# Altium schematic sheet 主控原理图(AD档).SchDoc
size A3
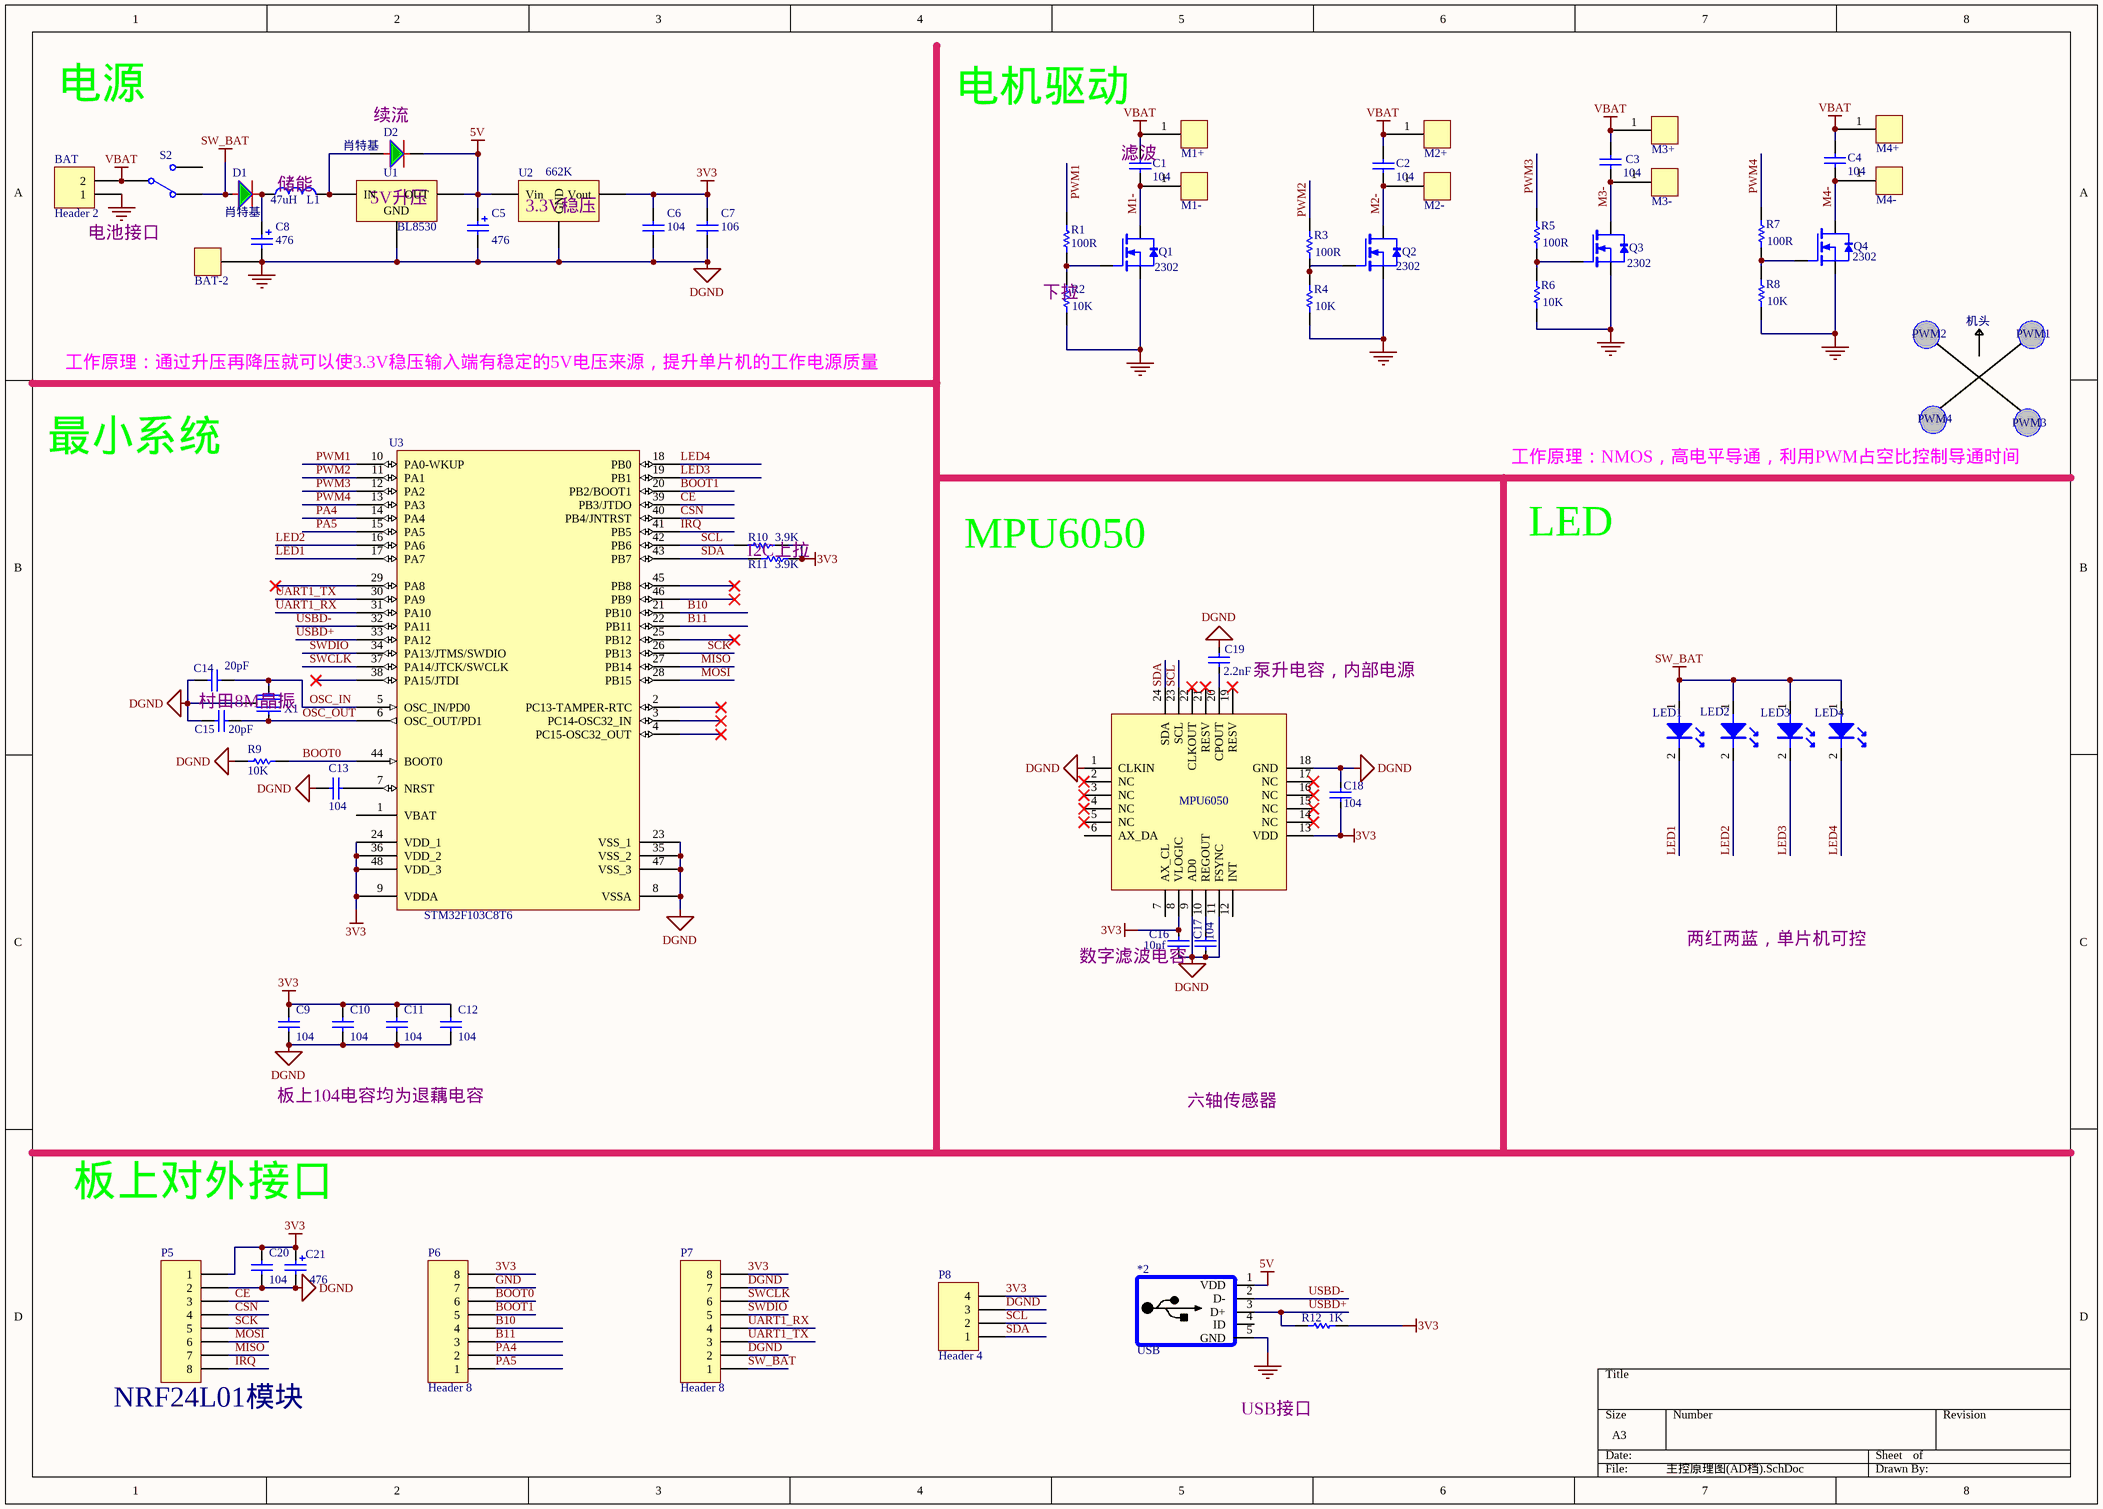
[diagram p0: 主控原理图(AD档).SchDoc]

## Parts
*2  USB  [USB]
BAT  Header 2  [HDR2]
BAT-2  Header 1  [电池接口]  (value not drawn)
C1  value 104  [0603C]  (hidden comment: Cap Chip 1206)
C2  104  [0603C]
C3  value 104  [0603C]  (hidden comment: Cap Chip 1206)
C4  value 104  [0603C]  (hidden comment: Cap Chip 1206)
C5  value 476  [1206c]  (hidden comment: Cap Tan A)
C6  value 104  [0603C]  (hidden comment: Cap Chip 1206)
C7  value 106  [0603c]  (hidden comment: Cap Chip 1206)
C8  value 476  [1206c]  (hidden comment: Cap Tan A)
C9  104  [0603C]
C10  104  [0603C]
C11  104  [0603C]
C12  104  [0603C]
C13  104  [0603C]
C14  20pF  [0603C]
C15  20pF  [0603C]
C16  value 10nf  [0603C]  (hidden comment: Cap_0603)
C17  value 104  [0603C]  (hidden comment: Cap_0603)
C18  value 104  [0603C]  (hidden comment: Cap_0603)
C19  value 2.2nF  [0603C]  (hidden comment: Cap_0603)
C20  104  [0603C]
C21  value 476  [1206c]  (hidden comment: Cap Tan A)
D1  肖特基  [0805d]
D2  肖特基  [0805d]
L1  value 47uH  [电感]  (hidden comment: Inductor Chip)
LED1  LED  [0603D]  (value not drawn)
LED2  LED  [0603D]  (value not drawn)
LED3  LED  [0603D]  (value not drawn)
LED4  LED  [0603D]  (value not drawn)
M1+  Header 1  [电池接口]  (value not drawn)
M1-  Header 1  [电池接口]  (value not drawn)
M2+  Header 1  [电池接口]  (value not drawn)
M2-  Header 1  [电池接口]  (value not drawn)
M3+  Header 1  [电池接口]  (value not drawn)
M3-  Header 1  [电池接口]  (value not drawn)
M4+  Header 1  [电池接口]  (value not drawn)
M4-  Header 1  [电池接口]  (value not drawn)
P5  NRF24L01模块  [2.4G]
P6  Header 8  [HDR8]
P7  Header 8  [HDR8]
P8  Header 4  [HDR4]
Q1  2302  [NMOS]
Q2  2302  [NMOS]
Q3  2302  [NMOS]
Q4  2302  [NMOS]
R1  value 100R  [0603R]  (hidden comment: Res1)
R2  value 10K  [0603R]  (hidden comment: Res1)
R3  value 100R  [0603R]  (hidden comment: Res1)
R4  value 10K  [0603R]  (hidden comment: Res1)
R5  value 100R  [0603R]  (hidden comment: Res1)
R6  value 10K  [0603R]  (hidden comment: Res1)
R7  value 100R  [0603R]  (hidden comment: Res1)
R8  value 10K  [0603R]  (hidden comment: Res1)
R9  value 10K  [0603R]  (hidden comment: Res1)
R10  value 3.9K  [0603R]  (hidden comment: Res1)
R11  value 3.9K  [0603R]  (hidden comment: Res1)
R12  value 1K  [0603R]  (hidden comment: Res1)
S2  SW-SPDT  [SWITCH]  (value not drawn)
U1  BL8530  [SOT-89]
U2  662K  [LDO]
U3  STM32F103C8T6  [LQFP48]
U8  MPU6050  [QFN24]
X1  XTAL_SMT  [OSC]  (value not drawn)

## Nets
3V3: C6.1 C7.1 C9.1 C10.1 C11.1 C12.1 C16.2 C18.1 C20.1 C21.2 P5.1 P6.8 P7.8 P8.4 R10.1 R11.1 R12.1 U2.2(Vout) U3.9(VDDA) U3.24(VDD_1) U3.36(VDD_2) U3.48(VDD_3) U8.8(VLOGIC) U8.13(VDD)
5V: *2.1(VDD) C5.2 D2.2 U1.2(OUT) U2.3(Vin)
DGND: *2.5(GND) BAT.1 BAT-2.1 C5.1 C6.2 C7.2 C8.1 C9.2 C10.2 C11.2 C12.2 C13.1 C14.2 C15.2 C16.1 C17.1 C18.2 C19.2 C20.2 C21.1 P5.2 P6.7 P7.2 P7.7 P8.3 Q1.3(S) Q2.3(S) Q3.3(S) Q4.3(S) R2.1 R4.1 R6.1 R8.1 R9.2 U1.1(GND) U2.1(GND) U3.8(VSSA) U3.23(VSS_1) U3.35(VSS_2) U3.47(VSS_3) U8.1(CLKIN) U8.9(AD0) U8.11(FSYNC) U8.18(GND) X1.0  [also labelled GND]
SW_BAT: D1.1 LED1.1 LED2.1 LED3.1 LED4.1 P7.1 S2.3
VBAT: BAT.2 C1.2 C2.2 C3.2 C4.2 M1+.1 M2+.1 M3+.1 M4+.1 S2.2
B10: P6.4 U3.21(PB10)
B11: P6.3 U3.22(PB11)
BOOT0: P6.6 R9.1 U3.44(BOOT0)
BOOT1: P6.5 U3.20(PB2/BOOT1)
CE: P5.3 U3.39(PB3/JTDO)
CSN: P5.4 U3.40(PB4/JNTRST)
IRQ: P5.8 U3.41(PB5)
LED1: LED1.2 U3.17(PA7)
LED2: LED2.2 U3.16(PA6)
LED3: LED3.2 U3.19(PB1)
LED4: LED4.2 U3.18(PB0)
M1-: C1.1 M1-.1 Q1.2(D)
M2-: C2.1 M2-.1 Q2.2(D)
M3-: C3.1 M3-.1 Q3.2(D)
M4-: C4.1 M4-.1 Q4.2(D)
MISO: P5.7 U3.27(PB14)
MOSI: P5.6 U3.28(PB15)
OSC_IN: C14.1 U3.5(OSC_IN/PD0) X1.2
OSC_OUT: C15.1 U3.6(OSC_OUT/PD1) X1.1
PA4: P6.2 U3.14(PA4)
PA5: P6.1 U3.15(PA5)
PWM1: R1.2 U3.10(PA0-WKUP)
PWM2: R3.2 U3.11(PA1)
PWM3: R5.2 U3.12(PA2)
PWM4: R7.2 U3.13(PA3)
SCK: P5.5 U3.26(PB13)
SCL: P8.2 R10.2 U3.42(PB6) U8.23(SCL)
SDA: P8.1 R11.2 U3.43(PB7) U8.24(SDA)
SWCLK: P7.6 U3.37(PA14/JTCK/SWCLK)
SWDIO: P7.5 U3.34(PA13/JTMS/SWDIO)
UART1_RX: P7.4 U3.31(PA10)
UART1_TX: P7.3 U3.30(PA9)
USBD+: *2.3(D+) R12.2 U3.33(PA12)
USBD-: *2.2(D-) U3.32(PA11)
NetC8_2: C8.2 D1.2 L1.1
NetC13_2: C13.2 U3.7(NRST)
NetC17_2: C17.2 U8.10(REGOUT)
NetC19_1: C19.1 U8.20(CPOUT)
NetD2_1: D2.1 L1.2 U1.3(IN)
NetQ1_1: Q1.1(G) R1.1 R2.2
NetQ2_1: Q2.1(G) R3.1 R4.2
NetQ3_1: Q3.1(G) R5.1 R6.2
NetQ4_1: Q4.1(G) R7.1 R8.2

Not connected (* = marked no-connect by the designer): *2 4(ID); S2 1; U3 1(VBAT) 2(PC13-TAMPER-RTC)* 3(PC14-OSC32_IN)* 4(PC15-OSC32_OUT)* 25(PB12)* 29(PA8)* 38(PA15/JTDI)* 45(PB8)* 46(PB9)*; U8 2(NC)* 3(NC)* 4(NC)* 5(NC)* 6(AX_DA) 7(AX_CL) 12(INT) 14(NC)* 15(NC)* 16(NC)* 17(NC)* 19(RESV)* 21(RESV)* 22(CLKOUT)*

## Notes on the sheet
- 电源
- 电机驱动
- (near D2) 续流
- (near C1) 滤波
- 电池接口
- (near L1) 储能
- (near U1) 5V升压
- (near U2) 3.3V稳压
- (near R2) 下拉
- 工作原理：通过升压再降压就可以使3.3V稳压输入端有稳定的5V电压来源，提升单片机的工作电源质量
- PWM2
- 机头
- PWM1
- PWM4
- PWM3
- 最小系统
- 工作原理：NMOS，高电平导通，利用PWM占空比控制导通时间
- I2C上拉
- MPU6050
- LED
- 村田8M晶振
- 泵升电容，内部电源
- 数字滤波电容
- 两红两蓝，单片机可控
- 板上104电容均为退藕电容
- 六轴传感器
- 板上对外接口
- USB接口

## Library data of the parts
BAT = Header 2: Header, 2-Pin; LatestRevisionDate: 17-Jul-2002; LatestRevisionNote: Re-released for DXP Platform.; Publisher: Altium Limited
C1-C4 C6 C7 = Cap Chip 1206: Polarized Capacitor (Radial); Published: 8-Jun-2000; Revision: July-2002: Re-released for DXP Platform.; Publisher: Altium Limited
  C2: Value: 104
C5 C8 C21 = Cap Tan A: Polarized Capacitor (Radial); Voltage: 16V; Published: 8-Jun-2000; Revision: July-2002: Re-released for DXP Platform.; Publisher: Altium Limited
C9-C15 C20 = C0603
C16-C19 = Cap_0603: Capacitor
D1 D2 = DIODE
L1 = Inductor Chip: Inductor; Published: 8-Jun-2000; Revision: July-2002: Re-released for DXP Platform.; Publisher: Altium Limited
P5-P7 = Header 8: Header, 8-Pin; LatestRevisionDate: 17-Jul-2002; LatestRevisionNote: Re-released for DXP Platform.; Publisher: Altium Limited
P8 = Header 4: Header, 4-Pin; LatestRevisionDate: 17-Jul-2002; LatestRevisionNote: Re-released for DXP Platform.; Publisher: Altium Limited
Q1 = N_MOS: N-Channel MOSFET
Q2-Q4 = N_MOS: N-Channel Power MOSFET
R1-R12 = Res1: Resistor; Published: 8-Jun-2000; LatestRevisionDate: 17-Jul-2002; LatestRevisionNote: Re-released for DXP Platform.; PackageReference: 0603_R; Publisher: Altium Limited; PackageDescription: Axial Device, Thru-Hole; 2 Leads; 0.3 in Pin Spacing
S2 = SW-SPDT: SPDT Subminiature Toggle Switch, Right Angle Mounting, Vertical Actuation; Published: 24-Mar-1999; LatestRevisionDate: 17-Dec-2003; LatestRevisionNote: Schematic revised, PCB Footprint replaced.; DatasheetVersion: 05-Dec-2000; PackageReference: TL36WW15050; Publisher: Altium Limited; PackageDescription: Switch; 4 Leads; ComponentLink1Description: Manufacturer Link; ComponentLink1URL: http://www.apem.com
U1 = HT7750: POSITIVE OUTPUT VOLTAGE
U2 = LM317: 3-Terminal Adjustable Positive Voltage Regulator